# EasyEDA schematic M482SIDv2.json
TITLE: M482SID Board with DAPLink; REV: 2.0; Date: 2021-12-11; Sheet: 1/1; Drawn By: XIVN1987
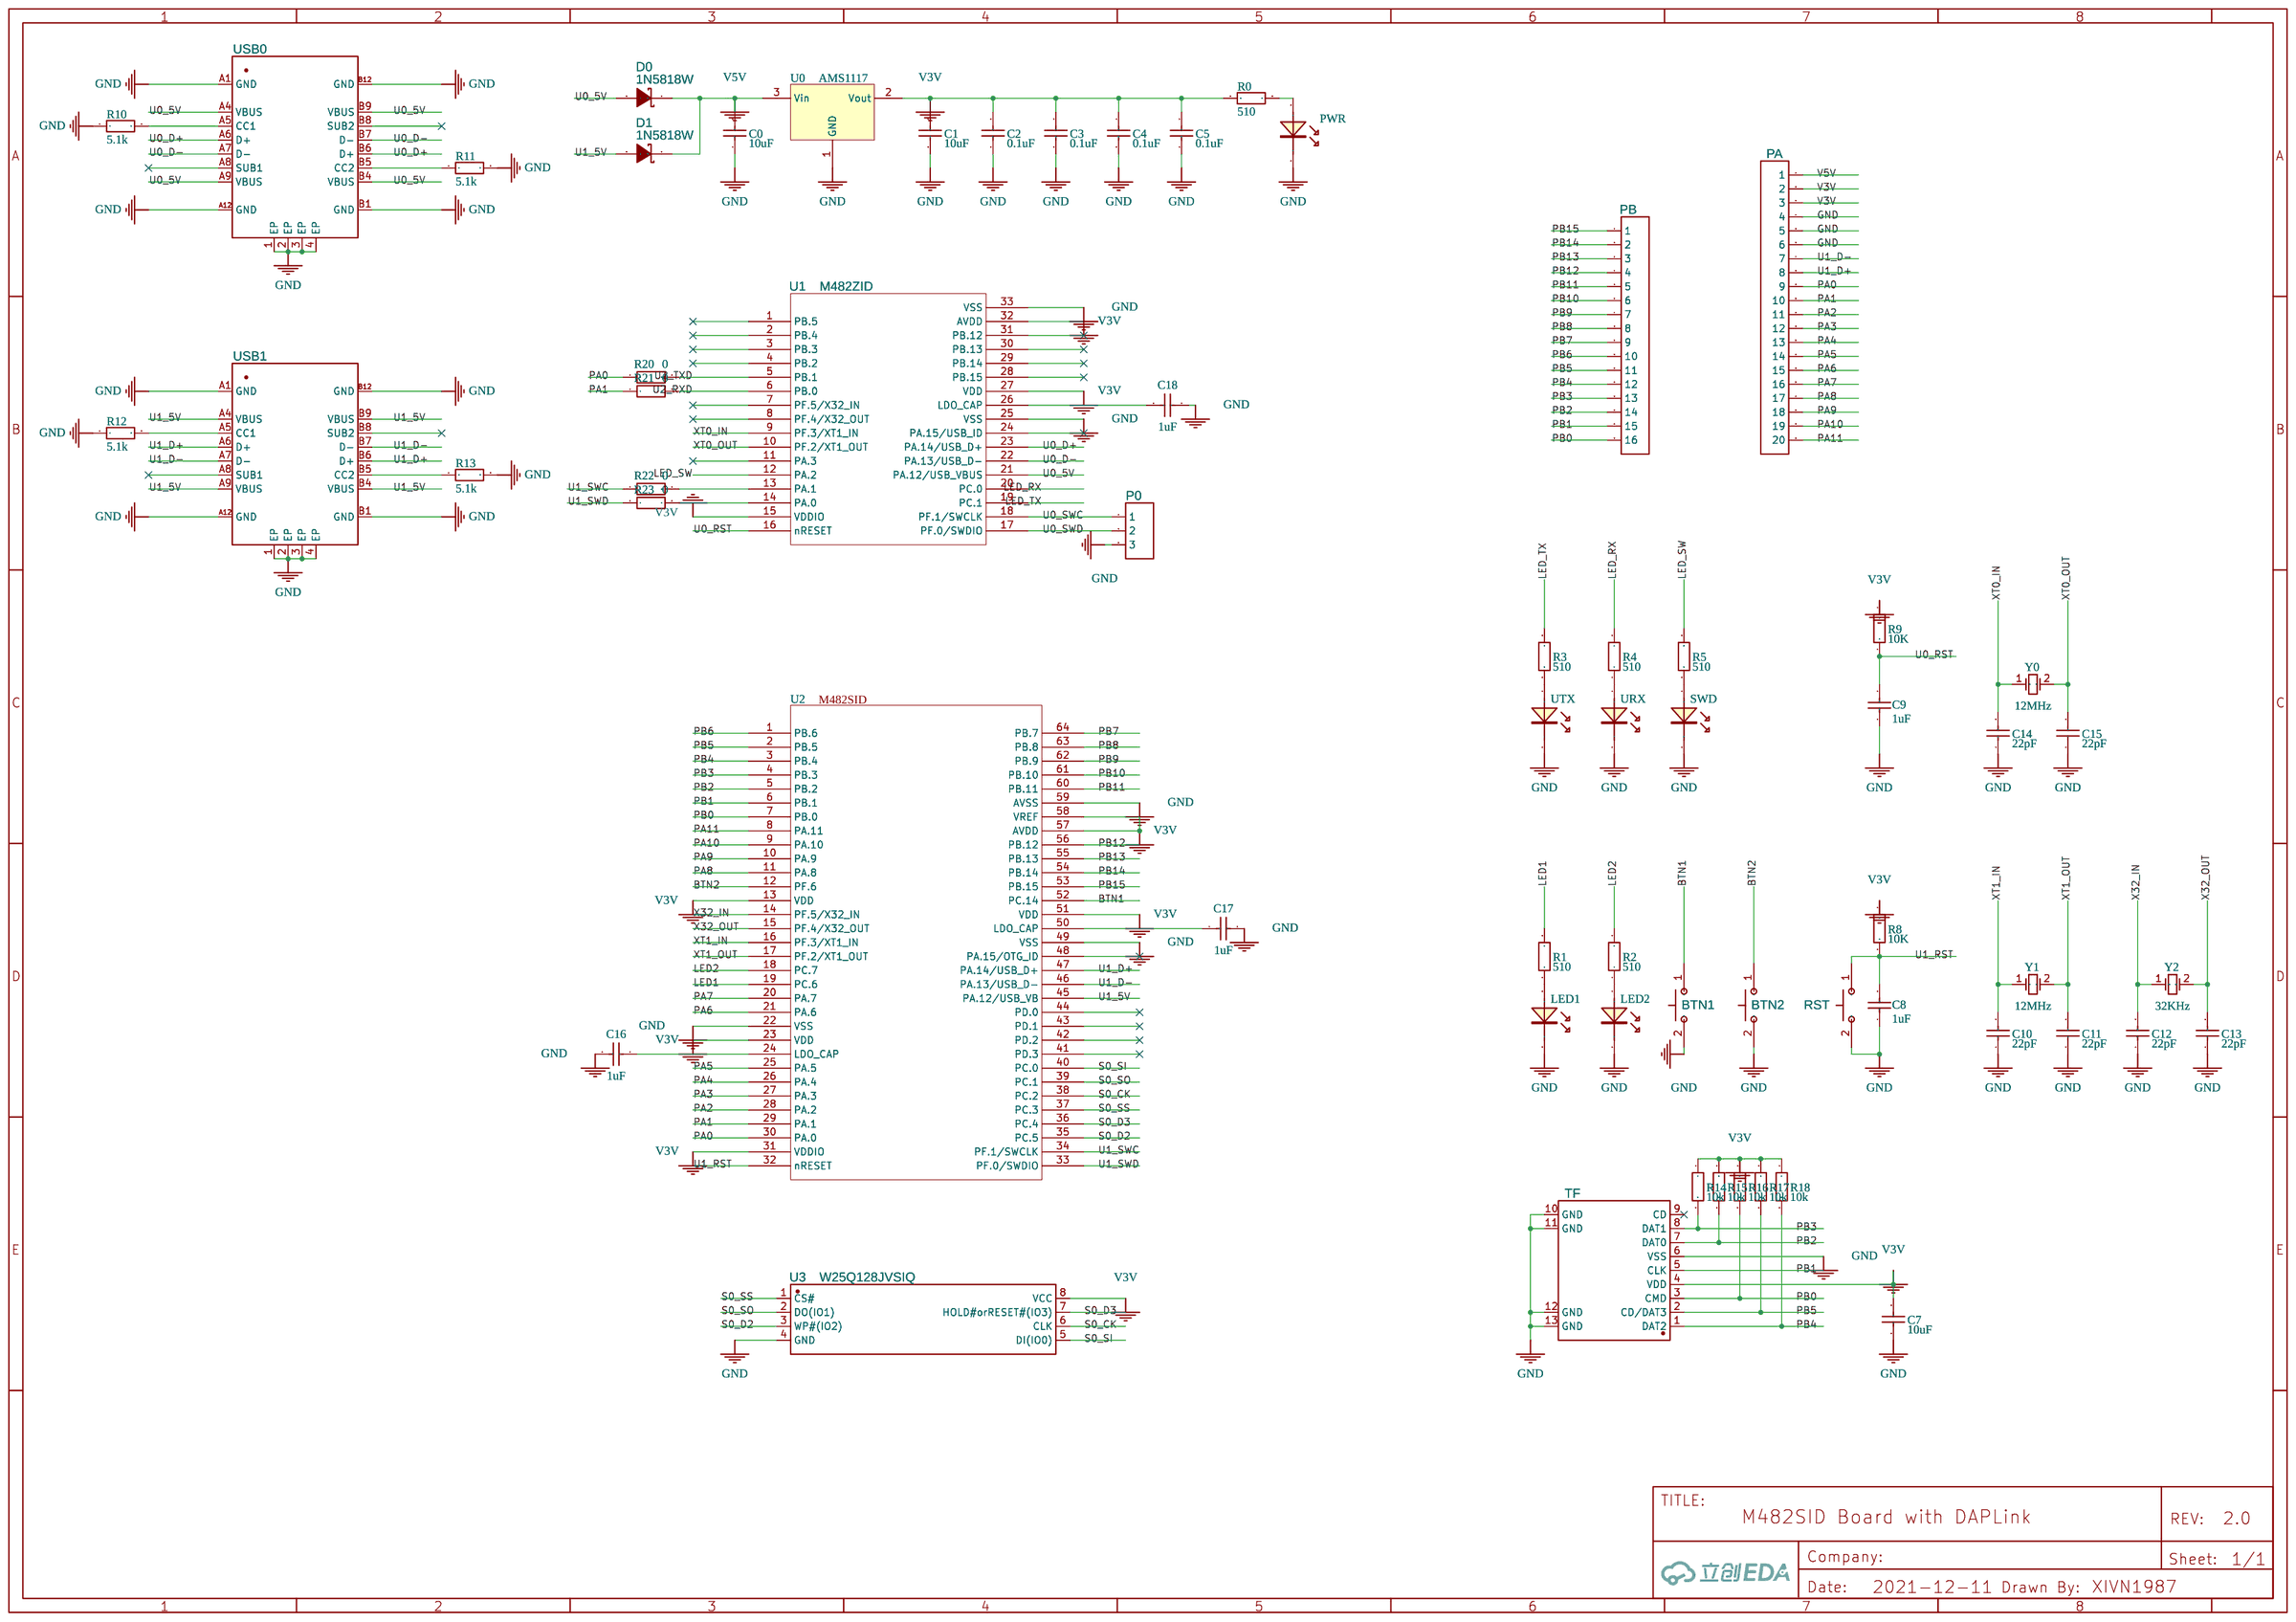
[diagram p0: schematic sheet]

## Parts
BTN1  1TS002B-2600-4301  [SW-SMD_L6.0-W3.5_1TS002B-2600-4301-CT]
BTN2  1TS002B-2600-4301  [SW-SMD_L6.0-W3.5_1TS002B-2600-4301-CT]
C0  10uF  [C0805]
C1  10uF  [C0805]
C2  0.1uF  [C0603]
C3  0.1uF  [C0603]
C4  0.1uF  [C0603]
C5  0.1uF  [C0603]
C7  10uF  [C0805]
C8  1uF  [C0603]
C9  1uF  [C0603]
C10  22pF  [C0603]
C11  22pF  [C0603]
C12  22pF  [C0603]
C13  22pF  [C0603]
C14  22pF  [C0603]
C15  22pF  [C0603]
C16  1uF  [C0603]
C17  1uF  [C0603]
C18  1uF  [C0603]
D0  1N5818W  [SOD-123FL_L2.8-W1.8-LS3.7-RD]
D1  1N5818W  [SOD-123FL_L2.8-W1.8-LS3.7-RD]
LED1  NO  [LED0805-FD]
LED2  NO  [LED0805-FD]
P0  HDR-M-2.54_1x3  [HDR-M-2.54_1X3]
PA  HDR-M-2.54_1x20  [HDR-M-2.54_1X20]
PB  HDR-M-2.54_1x16  [HDR-M-2.54_1X16]
PWR  NO  [LED0805-FD]
R0  510  [R0805]
R1  510  [R0805]
R2  510  [R0805]
R3  510  [R0805]
R4  510  [R0805]
R5  510  [R0805]
R8  10K  [R0603]
R9  10K  [R0603]
R10  5.1k  [R0603]
R11  5.1k  [R0603]
R12  5.1k  [R0603]
R13  5.1k  [R0603]
R14  10k  [R0603]
R15  10k  [R0603]
R16  10k  [R0603]
R17  10k  [R0603]
R18  10k  [R0603]
R20  0  [R0603]
R21  0  [R0603]
R22  0  [R0603]
R23  0  [R0603]
RST  1TS002B-2600-4301  [SW-SMD_L6.0-W3.5_1TS002B-2600-4301-CT]
SWD  NO  [LED0805-FD]
TF  TF-01A_C2889258  [TF-SMD_TF-02]
U0  AMS1117  [SOT-223]
U1  M482ZID  [QFN-32_5X5X05P]
U2  *  [LQFP-64_7X7X04P]
U3  W25Q128JVSIQ  [SOIC-8_L5.3-W5.3-P1.27-LS8.0-BL]
URX  NO  [LED0805-FD]
USB0  KH-TYPE-C-16P-T  [USB-C-SMD_KH-TYPE-C-16P]
USB1  KH-TYPE-C-16P-T  [USB-C-SMD_KH-TYPE-C-16P]
UTX  NO  [LED0805-FD]
Y0  12MHz  [SMD-5032_2P]
Y1  12MHz  [SMD-5032_2P]
Y2  32KHz  [SMD-3215_2P]

## Library data of the parts
BTN1 BTN2 RST = 1TS002B-2600-4301: Supplier: LCSC; Supplier Part: C318835; Manufacturer: HYP; Contributor: LCSC; JLCPCB Part Class: Extended Part
D0 D1 = 1N5818W: Supplier: LCSC; Supplier Part: C437955; Manufacturer: Shandong Jingdao Microelectronics; Contributor: LCSC; JLCPCB Part Class: Extended Part
P0 = HDR-M-2.54_1x3: Supplier Part: C180248; Supplier: LCSC; Contributor: LCEDA_Lib
PA = HDR-M-2.54_1x20: Supplier Part: C50981; Supplier: LCSC; Contributor: LCEDA_Lib
PB = HDR-M-2.54_1x16: Supplier Part: C50981; Supplier: LCSC; Contributor: LCEDA_Lib
TF = TF-01A_C2889258: Supplier: LCSC; Supplier Part: C2889258; Manufacturer: Yuandi(台湾元迪); Manufacturer Part: TF-01A; Contributor: LCSC
U1 = M482ZID: Contributor: XIVN1987
U2 = -: Comment: M482SID
U3 = W25Q128JVSIQ: Supplier: LCSC; Supplier Part: C113767; Manufacturer: Winbond Elec; Contributor: LCSC; JLCPCB Part Class: Extended Part
USB0 USB1 = KH-TYPE-C-16P-T: Supplier: LCSC; Supplier Part: C709358; Manufacturer: Shenzhen Kinghelm Elec; Contributor: LCSC; JLCPCB Part Class: Extended Part

## Nets
GND: BTN1.2(B) BTN2.2(B) C0.1 C1.1 C2.1 C3.1 C4.1 C5.1 C7.1 C8.1 C9.1 C10.1 C11.1 C12.1 C13.1 C14.1 C15.1 C16.2 C17.2 C18.1 LED1.2(K) LED2.2(K) P0.3 PA.4 PA.5 PA.6 PWR.2(K) R10.1 R11.2 R12.1 R13.2 RST.2(B) SWD.2(K) TF.6(VSS) TF.10(GND) TF.11(GND) TF.12(GND) TF.13(GND) U0.1(GND) U1.25(VSS) U1.33(VSS) U2.22(VSS) U2.49(VSS) U2.59(AVSS) U3.4(GND) URX.2(K) USB0.1(EP) USB0.2(EP) USB0.3(EP) USB0.4(EP) USB0.A1(GND) USB0.A12(GND) USB0.B1(GND) USB0.B12(GND) USB1.1(EP) USB1.2(EP) USB1.3(EP) USB1.4(EP) USB1.A1(GND) USB1.A12(GND) USB1.B1(GND) USB1.B12(GND) UTX.2(K)
V3V: C1.2 C2.2 C3.2 C4.2 C5.2 C7.2 PA.2 PA.3 R0.1 R8.1 R9.1 R14.1 R15.1 R16.1 R17.1 R18.1 TF.4(VDD) U0.2(Vout) U1.15(VDDIO) U1.27(VDD) U1.32(AVDD) U2.13(VDD) U2.23(VDD) U2.31(VDDIO) U2.51(VDD) U2.57(AVDD) U2.58(VREF) U3.8(VCC)
V5V: C0.2 D0.1(C) D1.1(C) PA.1 U0.3(Vin)
BTN1: BTN1.1(A) U2.52(PC.14)
BTN2: BTN2.1(A) U2.12(PF.6)
LED1: R1.2 U2.19(PC.6)
LED2: R2.2 U2.18(PC.7)
LED_RX: R4.2 U1.20(PC.0)
LED_SW: R5.2 U1.12(PA.2)
LED_TX: R3.2 U1.19(PC.1)
PA0: PA.9 R20.1 U2.30(PA.0)
PA1: PA.10 R21.1 U2.29(PA.1)
PA2: PA.11 U2.28(PA.2)
PA3: PA.12 U2.27(PA.3)
PA4: PA.13 U2.26(PA.4)
PA5: PA.14 U2.25(PA.5)
PA6: PA.15 U2.21(PA.6)
PA7: PA.16 U2.20(PA.7)
PA8: PA.17 U2.11(PA.8)
PA9: PA.18 U2.10(PA.9)
PA10: PA.19 U2.9(PA.10)
PA11: PA.20 U2.8(PA.11)
PB0: PB.16 R16.2 TF.3(CMD) U2.7(PB.0)
PB1: PB.15 TF.5(CLK) U2.6(PB.1)
PB2: PB.14 R15.2 TF.7(DAT0) U2.5(PB.2)
PB3: PB.13 R14.2 TF.8(DAT1) U2.4(PB.3)
PB4: PB.12 R18.2 TF.1(DAT2) U2.3(PB.4)
PB5: PB.11 R17.2 TF.2(CD/DAT3) U2.2(PB.5)
PB6: PB.10 U2.1(PB.6)
PB7: PB.9 U2.64(PB.7)
PB8: PB.8 U2.63(PB.8)
PB9: PB.7 U2.62(PB.9)
PB10: PB.6 U2.61(PB.10)
PB11: PB.5 U2.60(PB.11)
PB12: PB.4 U2.56(PB.12)
PB13: PB.3 U2.55(PB.13)
PB14: PB.2 U2.54(PB.14)
PB15: PB.1 U2.53(PB.15)
S0_CK: U2.38(PC.2) U3.6(CLK)
S0_D2: U2.35(PC.5) U3.3(WP#(IO2))
S0_D3: U2.36(PC.4) U3.7(HOLD#orRESET#(IO3))
S0_SI: U2.40(PC.0) U3.5(DI(IO0))
S0_SO: U2.39(PC.1) U3.2(DO(IO1))
S0_SS: U2.37(PC.3) U3.1(CS#)
U0_5V: D0.2(A) U1.21(PA.12/USB_VBUS) USB0.A4(VBUS) USB0.A9(VBUS) USB0.B4(VBUS) USB0.B9(VBUS)
U0_D+: U1.23(PA.14/USB_D+) USB0.A6(D+) USB0.B6(D+)
U0_D-: U1.22(PA.13/USB_D-) USB0.A7(D-) USB0.B7(D-)
U0_RST: C9.2 R9.2 U1.16(nRESET)
U0_SWC: P0.1 U1.18(PF.1/SWCLK)
U0_SWD: P0.2 U1.17(PF.0/SWDIO)
U1_5V: D1.2(A) U2.45(PA.12/USB_VB) USB1.A4(VBUS) USB1.A9(VBUS) USB1.B4(VBUS) USB1.B9(VBUS)
U1_D+: PA.8 U2.47(PA.14/USB_D+) USB1.A6(D+) USB1.B6(D+)
U1_D-: PA.7 U2.46(PA.13/USB_D-) USB1.A7(D-) USB1.B7(D-)
U1_RST: C8.2 R8.2 RST.1(A) U2.32(nRESET)
U1_SWC: R22.1 U2.34(PF.1/SWCLK)
U1_SWD: R23.1 U2.33(PF.0/SWDIO)
U2_RXD: R21.2 U1.6(PB.0)
U2_TXD: R20.2 U1.5(PB.1)
X32_IN: C12.2 U2.14(PF.5/X32_IN) Y2.1(OSC1)
X32_OUT: C13.2 U2.15(PF.4/X32_OUT) Y2.2(OSC2)
XT0_IN: C14.2 U1.9(PF.3/XT1_IN) Y0.1(OSC1)
XT0_OUT: C15.2 U1.10(PF.2/XT1_OUT) Y0.2(OSC2)
XT1_IN: C10.2 U2.16(PF.3/XT1_IN) Y1.1(OSC1)
XT1_OUT: C11.2 U2.17(PF.2/XT1_OUT) Y1.2(OSC2)
Net-(C16-1): C16.1 U2.24(LDO_CAP)
Net-(C17-1): C17.1 U2.50(LDO_CAP)
Net-(C18-2): C18.2 U1.26(LDO_CAP)
Net-(LED1-1): LED1.1(A) R1.1
Net-(LED2-1): LED2.1(A) R2.1
Net-(PWR-1): PWR.1(A) R0.2
Net-(R3-1): R3.1 UTX.1(A)
Net-(R4-1): R4.1 URX.1(A)
Net-(R5-1): R5.1 SWD.1(A)
Net-(R10-2): R10.2 USB0.A5(CC1)
Net-(R11-1): R11.1 USB0.B5(CC2)
Net-(R12-2): R12.2 USB1.A5(CC1)
Net-(R13-1): R13.1 USB1.B5(CC2)
Net-(R22-2): R22.2 U1.13(PA.1)
Net-(R23-2): R23.2 U1.14(PA.0)

Not connected (* = marked no-connect by the designer): TF 9(CD)*; U1 1(PB.5) 2(PB.4) 3(PB.3) 4(PB.2) 7(PF.5/X32_IN) 8(PF.4/X32_OUT) 11(PA.3) 24(PA.15/USB_ID) 28(PB.15) 29(PB.14) 30(PB.13) 31(PB.12); U2 41(PD.3) 42(PD.2) 43(PD.1) 44(PD.0) 48(PA.15/OTG_ID); USB0 A8(SUB1) B8(SUB2); USB1 A8(SUB1) B8(SUB2)
